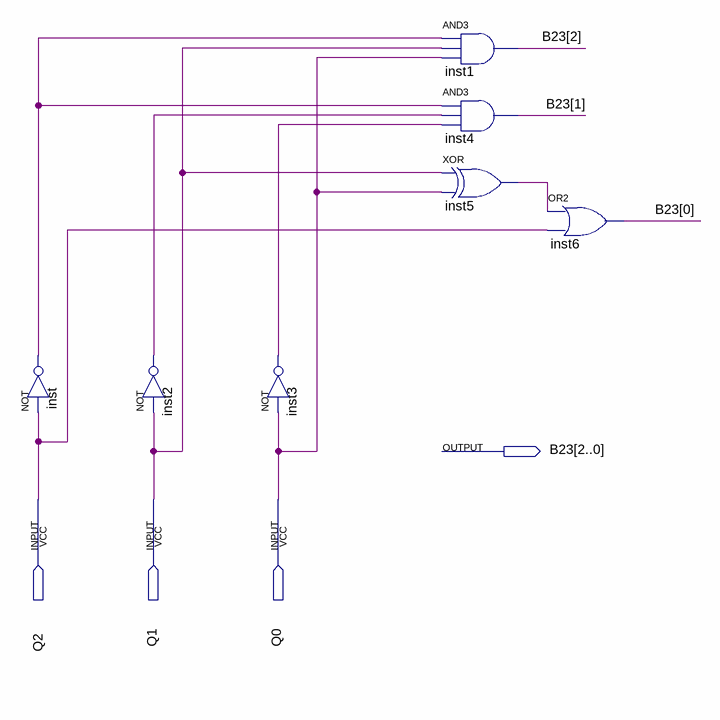
[diagram p0: schematic sheet]
// Quartus schematic B23_C3.bdf as structural Verilog: 7 symbols, 4 pins
module B23_C3 (
  input  Q2,
  input  Q1,
  input  Q0,
  output [2:0] B23
);

  wire inst2_out, inst3_out, inst5_out, inst_out;

  not inst (inst_out, Q2);
  not inst2 (inst2_out, Q1);
  not inst3 (inst3_out, Q0);
  and inst1 (B23[2], inst_out, Q1, Q0);
  and inst4 (B23[1], inst_out, inst2_out, inst3_out);
  xor inst5 (inst5_out, Q1, Q0);
  or inst6 (B23[0], inst5_out, Q2);
endmodule
